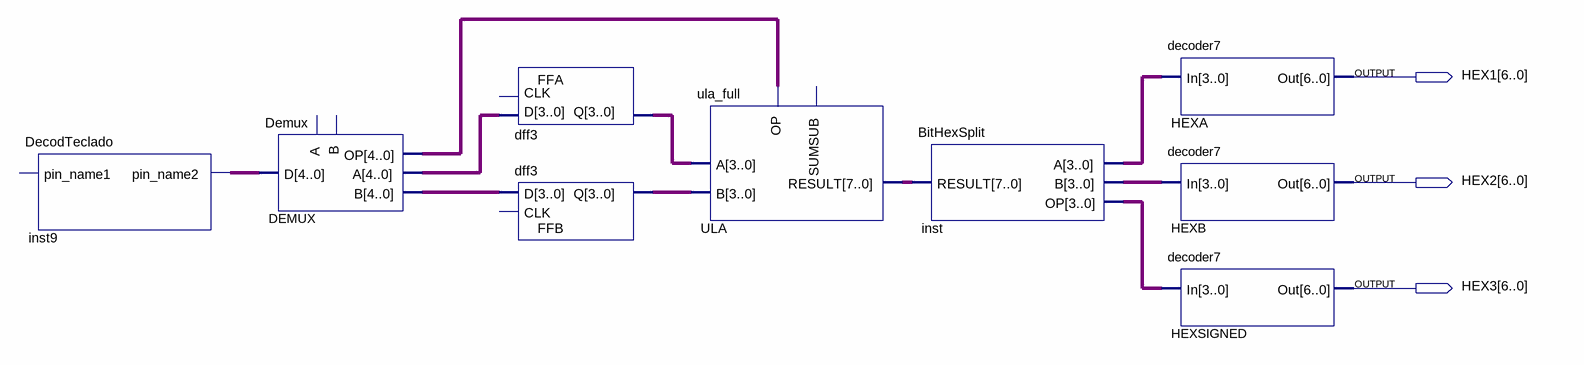
[diagram p0: schematic sheet]
// Quartus schematic Calculator.bdf as structural Verilog: 9 symbols, 3 pins
module Calculator (
  output [6:0] HEX1,
  output [6:0] HEX2,
  output [6:0] HEX3
);

  wire [3:0] FFA_q, FFB_q, inst_a, inst_b, inst_op;
  wire [4:0] DEMUX_a, DEMUX_b, DEMUX_op, inst9_pin_name2;
  wire [7:0] ULA_result;

  DecodTeclado inst9 (.pin_name2(inst9_pin_name2));  // open: pin_name1
  Demux DEMUX (
    .A({DEMUX_a[4:1], 1'bz, DEMUX_a[0]}), .B({DEMUX_b[4:1], 1'bz, DEMUX_b[0]}), .D(inst9_pin_name2),
    .OP(DEMUX_op));
  dff3 FFA (.D(DEMUX_a), .Q(FFA_q));  // open: CLK
  dff3 FFB (.D(DEMUX_b), .Q(FFB_q));  // open: CLK
  ula_full ULA (.OP(DEMUX_op), .A(FFA_q), .B(FFB_q), .RESULT(ULA_result));  // open: SUMSUB
  BitHexSplit inst (.RESULT(ULA_result), .A(inst_a), .B(inst_b), .OP(inst_op));
  decoder7 HEXA (.In(inst_a), .Out(HEX1));
  decoder7 HEXB (.In(inst_b), .Out(HEX2));
  decoder7 HEXSIGNED (.In(inst_op), .Out(HEX3));
endmodule
